# EAGLE design boron (EAGLE 8.1.1)
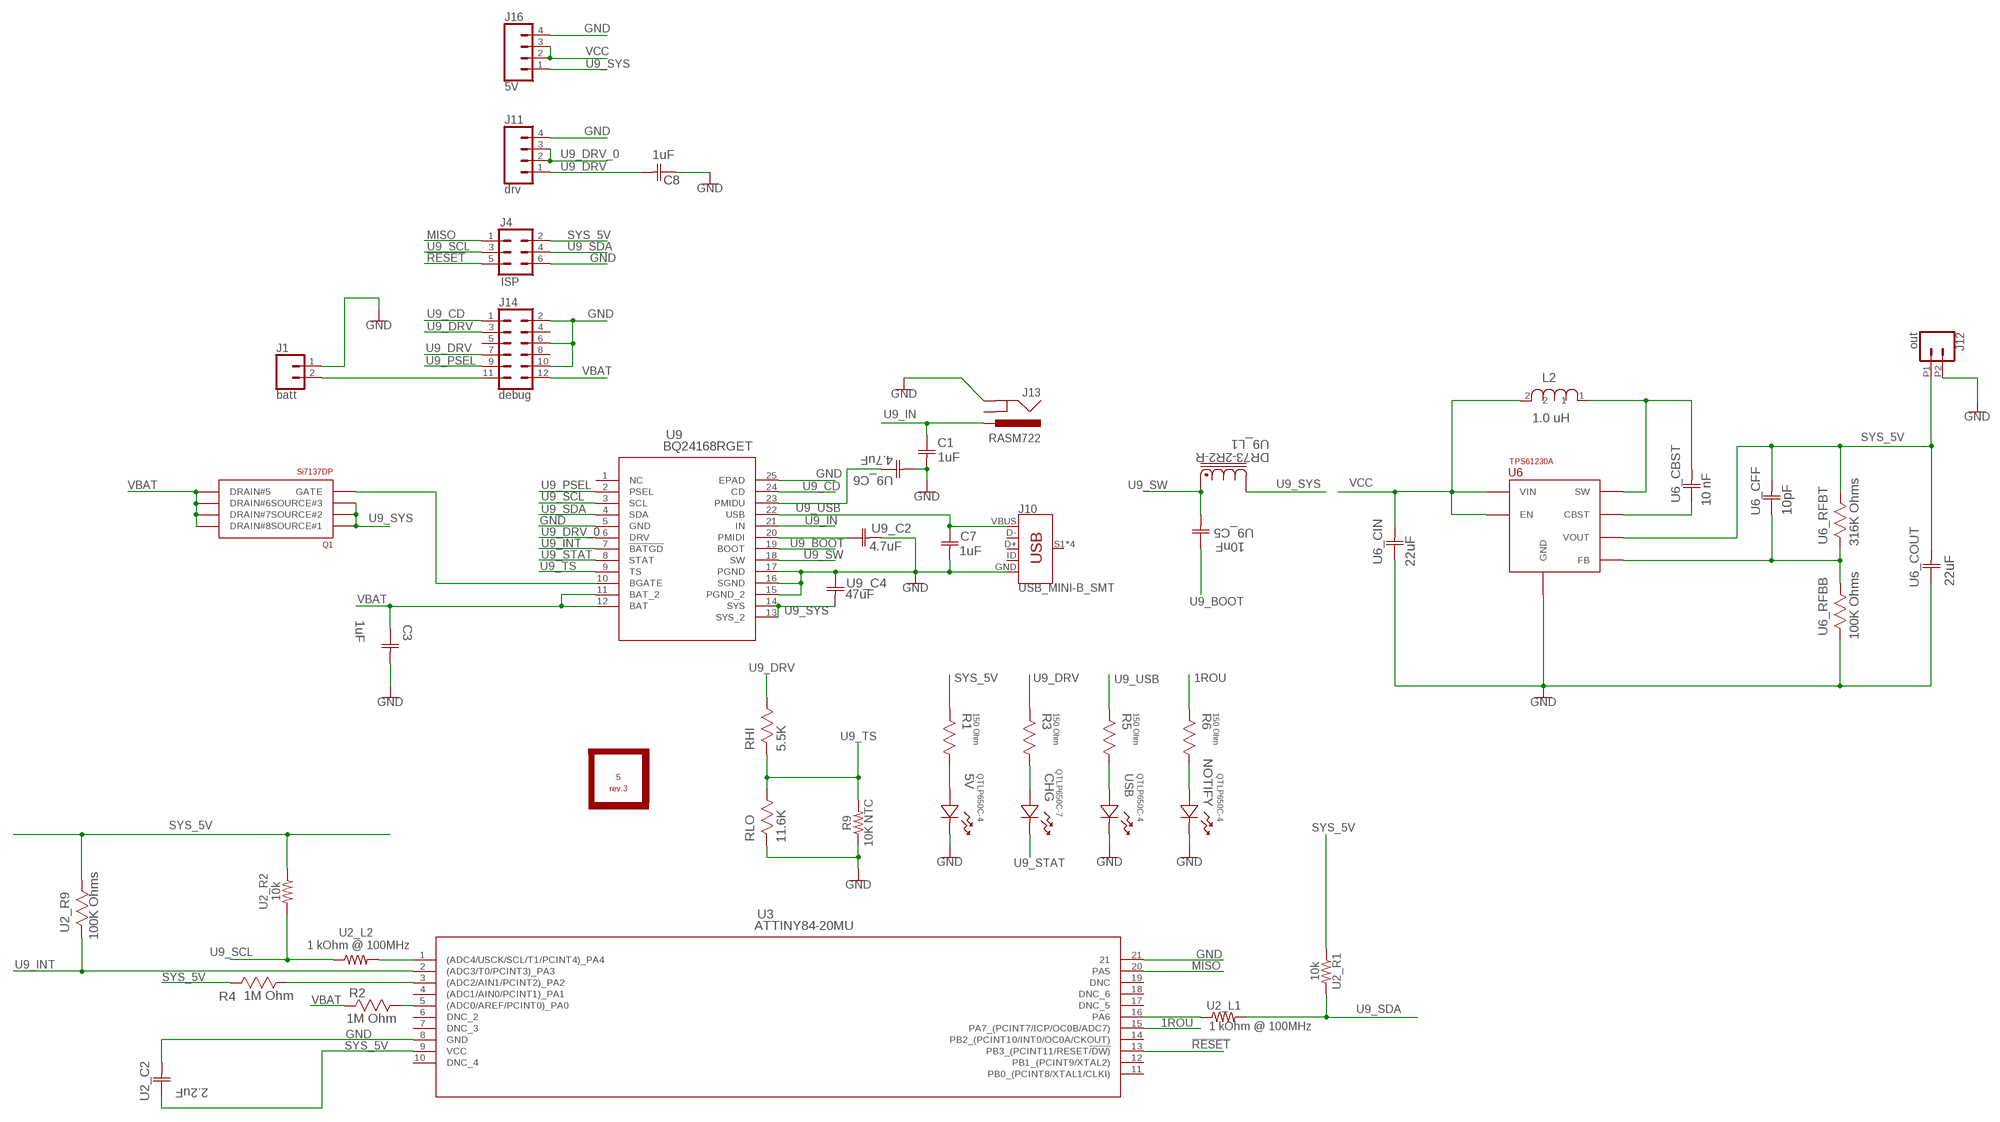
[diagram p0: schematic, sheet 1]

## Parts
5  rev.3  PERIODIC_SYMBOL  [PERIODIC_SYMBOL_BACK]
5V  QTLP650C-4  597-3311-407F  [LED_597-3311-407F]
C1  1uF  06033D105KAT2A  [CAPC1608X94N]
C3  1uF  06033D105KAT2A  [CAPC1608X94N]
C7  1uF  06033D105KAT2A  [CAPC1608X94N]
C8  1uF  06033D105KAT2A  [CAPC1608X94N]
CHG  QTLP650C-7  597-3111-407F  [LED_597-3111-407F]
J1  batt  CONN_02-JST-2MM-SMT  [JST-2-SMD]
J4  ISP  CONN_03X2FEMALE  [2X3]
J10  USB_MINI-B_SMT  [USB-MINIB]
J11  drv  CONN_04  [1X04]
J12  out  CONN_022.54MM_SCREWTERM  [1X02_2.54_SCREWTERM]
J13  RASM722  [RASM722]
J14  debug  CONN_06X2PTH_FEMALE  [2X6]
J16  5V  CONN_04  [1X04]
L2  1.0 uH  PM1210-1R0J-RC  [INDC3225X22N]
NOTIFY  QTLP650C-4  597-3311-407F  [LED_597-3311-407F]
Q1  Si7137DP  SI7137DP  [SO-8]
R1  150 Ohm  ERA-6AEB151V  [RESC2013X65N]
R2  1M Ohm  CRCW06031M00JNEA  [RESC1608X60N]
R3  150 Ohm  ERA-6AEB151V  [RESC2013X65N]
R4  1M Ohm  CRCW06031M00JNEA  [RESC1608X60N]
R5  150 Ohm  ERA-6AEB151V  [RESC2013X65N]
R6  150 Ohm  ERA-6AEB151V  [RESC2013X65N]
R9  10K NTC  NTHS1206N02N1002JE  [1206]
RHI  5.5K  CRCW060311K0FKEA  [RESC1608X60N]
RLO  11.6K  CRCW060311K0FKEA  [RESC1608X60N]
U2_C2  2.2uF  0402ZD225KAT2A  [CAPC1005X60N]
U2_L1  1 kOhm @ 100MHz  RESISTOR0402  [0402]
U2_L2  1 kOhm @ 100MHz  RESISTOR0402  [0402]
U2_R1  10k  RESISTOR0402  [0402]
U2_R2  10k  RESISTOR0402  [0402]
U2_R9  100K Ohms  CRCW0402100KJNED  [RESC1005X40N]
U3  ATTINY84-20MU  [20M1]
U6  TPS61230A  [VQFN7]
U6_CBST  10 nF  C0402C103K5RACTU  [CAPC1005X60N]
U6_CFF  10pF  C0603C100J5GACTU  [CAPC1608X85N]
U6_CIN  22uF  GRM21BR60J226ME39L  [CAPC2013X135N]
U6_COUT  22uF  GRM32ER61C226KE20L  [CAPC3225X270N]
U6_RFBB  100K Ohms  CRCW0402100KFKED  [RESC1005X40N]
U6_RFBT  316K Ohms  CRCW0402316KFKED  [RESC1005X40N]
U9  BQ24168RGET  [RGE24_2P7X2P7]
U9_C2  4.7uF  08053D475KAT2A  [CAPC2013X140N]
U9_C4  47uF  12067C332KAT2A  [CAPC3216X127N]
U9_C5  10nF  06035C103KAZ2A  [CAPC1608X90N]
U9_C6  4.7uF  08053D475KAT2A  [CAPC2013X140N]
U9_L1  DR73-2R2-R  [DR73]
USB  QTLP650C-4  597-3311-407F  [LED_597-3311-407F]

## Nets
1ROU: R6.2(R2) U3.15(PA7_(PCINT7/ICP/OC0B/ADC7))
!RESET: J4.5 U3.13(PB3_(PCINT11/RESET!/DW))
ADC0: R2.1 U3.5((ADC0/AREF/PCINT0)_PA0)
ADC2: R4.1 U3.3((ADC2/AIN1/PCINT2)_PA2)
GND: 5V.1 C1.2(C2) C3.2(C2) C7.2(C2) C8.1(C1) J1.1 J4.6 J10.GND J11.4 J12.P2 J13.SLEEVE(GND) J14.2 J14.6 J14.10 J16.4 NOTIFY.1 R9.1 RLO.2 U2_C2.1(C2) U3.8(GND) U3.21 U6.P$6(GND) U6_CIN.1(C1) U6_COUT.1(C1) U6_RFBB.2 U9.5(GND) U9.15(PGND_2) U9.16(SGND) U9.17(PGND) U9.25(EPAD) U9_C2.2(C2) U9_C4.1(C1) U9_C6.2(C2) USB.1
LA_1: NOTIFY.2 R6.1(R1)
LA_5: 5V.2 R1.1(R1)
LA_CHG: CHG.2 R3.1(R1)
LA_USB: R5.1(R1) USB.2
MISO: J4.1 U3.20(PA5)
SYS_5V: J4.2 J12.P1 R1.2(R2) R4.2 U2_C2.2(C1) U2_R1.1 U2_R2.1 U2_R9.1 U3.9(VCC) U6.P$7(VOUT) U6_CFF.2(C2) U6_COUT.2(C2) U6_RFBT.1
U3_PA4: U2_L2.2 U3.1((ADC4/USCK/SCL/T1/PCINT4)_PA4)
U3_PA6: U2_L1.1 U3.16(PA6)
U6_CBST: U6.P$1(CBST) U6_CBST.1(C1)
U6_FB: U6.P$3(FB) U6_CFF.1(C1) U6_RFBB.1 U6_RFBT.2
U6_SW: L2.1 U6.P$5(SW) U6_CBST.2(C2)
U9_BGATE: Q1.P$4(GATE) U9.10(BGATE)
U9_BOOT: U9.19(BOOT) U9_C5.1(C1)
U9_CD: J14.1 U9.24(CD)
U9_DRV: C8.2(C2) J11.1 J14.3 J14.7 R3.2(R2) RHI.1
U9_DRV_0: J11.2 J11.3 U9.6(DRV)
U9_IN: C1.1(C1) J13.TIP(PWR) U9.21(IN)
U9_INT: U2_R9.2 U3.2((ADC3/T0/PCINT3)_PA3) U9.7(!BATGD)
U9_PMIDI: U9.20(PMIDI) U9_C2.1(C1)
U9_PMIDU: U9.23(PMIDU) U9_C6.1(C1)
U9_PSEL: J14.9 U9.2(PSEL)
U9_SCL: J4.3 U2_L2.1 U2_R2.2 U9.3(SCL)
U9_SDA: J4.4 U2_L1.2 U2_R1.2 U9.4(SDA)
U9_STAT: CHG.1 U9.8(STAT)
U9_SW: U9.18(SW) U9_C5.2(C2) U9_L1.1
U9_SYS: J16.1 Q1.P$1(SOURCE#1) Q1.P$2(SOURCE#2) Q1.P$3(SOURCE#3) U9.13(SYS_2) U9.14(SYS) U9_C4.2(C2) U9_L1.2
U9_TS: R9.2 RHI.2 RLO.1 U9.9(TS)
U9_USB: C7.1(C1) J10.VBUS R5.2(R2) U9.22(USB)
VBAT: C3.1(C1) J14.12 Q1.P$5(DRAIN#5) Q1.P$6(DRAIN#6) Q1.P$7(DRAIN#7) Q1.P$8(DRAIN#8) Q1.P$9(DRAIN#8) R2.2 U9.11(BAT_2) U9.12(BAT)
VBAT_CON: J1.2 J14.11
VCC: J16.2 J16.3 L2.2 U6.P$2(EN) U6.P$4(VIN) U6_CIN.2(C2)
Unconnected: J10.D+ J10.D- J10.ID J10.S1(SHIELD) J10.S2(SHIELD) J10.S3(SHIELD) J10.S4(SHIELD) J14.4 J14.5 J14.8 U3.4((ADC1/AIN0/PCINT1)_PA1) U3.6(DNC_2) U3.7(DNC_3) U3.10(DNC_4) U3.11(PB0_(PCINT8/XTAL1/CLKI)) U3.12(PB1_(PCINT9/XTAL2)) U3.14(PB2_(PCINT10/INT0/OC0A/CKOUT)) U3.17(DNC_5) U3.18(DNC_6) U3.19(DNC) U9.1(NC)

## Power pins joined to a net without a drawn wire
GNDBREAK: J13.SHUNT(GNDBREAK)

## Library data of the parts
5 = 32bits:PERIODIC_SYMBOL; ELEMENT: B
5V NOTIFY USB = Dialight_By_element14_Batch_1:597-3311-407F: LED 1206 Green SMT; COLOR: Green; MPN: 597-3311-407F; OC_FARNELL: 1519493; OC_NEWARK: 30K4957; PACKAGE: 1206- Green LED; SUPPLIER: Dialight
C1 C3 C7 C8 = AVX_By_element14_Batch_1:06033D105KAT2A: Capacitor 0603; MPN: 06033D105KAT2A; OC_FARNELL: 1658868; OC_NEWARK: 96M1265; SUPPLIER: AVX; TOLERANCE: ±10%; VOLTAGERATING: 25V
CHG = Dialight_By_element14_Batch_1:597-3111-407F: LED 1206 ALGAAS RED SMT; COLOR: AlGaAs Red; MPN: 597-3111-407F; OC_FARNELL: 1519490; OC_NEWARK: 30K4900; PACKAGE: 1206-RED LED; SUPPLIER: Dialight
J1 = SparkFun-Connectors:CONN_02: Multi connection point. Often used as Generic Header-pin footprint for 0.1 inch spaced/style header connections On any of the 0.1 inch spaced packages, you can populate with these: Break Away Headers - Straight <https://www.sparkfun.com/products/116> (PRT-00116) Break Away Male Headers - Right Angle <https://www.sparkfun.com/products/553> (PRT-00553) Female Headers <https://www.sparkfun.com/products/115> (PRT-00115) Break Away Headers - Machine Pin <https://www.sparkfun.com/products/117> (PRT-00117) Break Away Female Headers - Swiss Machine Pin <https://www.sparkfun.com/products/743> (PRT-00743) For SCREWTERMINALS and SPRING TERMINALS visit here: Screw Terimnals on SparkFun.com <https://www.sparkfun.com/search/results?term=Screw+Terminals> (5mm/3.5mm/2.54mm spacing) This device is also useful as a general connection point to wire up your design to another part of your project. Our various solder wires solder well into these plated through hole pads. Hook-Up Wire - Assortment (Stranded, 22 AWG) <https://www.sparkfun.com/products/11375> (PRT-11375) Hook-Up Wire - Assortment (Solid Core, 22 AWG) <https://www.sparkfun.com/products/11367> (PRT-11367) View the entire wire category on our website here <https://www.sparkfun.com/categories/141> Special notes: Molex polarized connector foot print use with: PRT-08233 with associated crimp pins and housings. 2.54_SCREWTERM for use with PRT-10571. 3.5mm Screw Terminal footprints for PRT-08084 5mm Screw Terminal footprints for use with PRT-08432; PROD_ID: CONN-11443
J4 = SparkFun-Connectors:CONN_03X2: Multi connection point. Often used as Generic Header-pin footprint for 0.1 inch spaced/style header connections You can populate with any combo of single row headers, but if you'd like an exact match, check these: Header - 2x3 (Male, 0.1") <https://www.sparkfun.com/products/12807> (PRT-12807) Header - 2x3 (Female, 0.1") <https://www.sparkfun.com/products/13010> (PRT-13010) 2x3 Pin Shrouded Header <https://www.sparkfun.com/products/10877> (PRT-10877) On any of the 0.1 inch spaced packages, you can populate with these: Break Away Headers - Straight <https://www.sparkfun.com/products/116> (PRT-00116) Break Away Male Headers - Right Angle <https://www.sparkfun.com/products/553> (PRT-00553) Female Headers <https://www.sparkfun.com/products/115> (PRT-00115) Break Away Headers - Machine Pin <https://www.sparkfun.com/products/117> (PRT-00117) Break Away Female Headers - Swiss Machine Pin <https://www.sparkfun.com/products/743> (PRT-00743) Special note: the shrouded connector mates well with our 3x2 ribbon cables: Ribbon Crimp Connector - 6-pin (2x3, Female) <https://www.sparkfun.com/products/10651> (PRT-10651) Ribbon Cable - 6 wire (15ft) <https://www.sparkfun.com/products/10646> (PRT-10646); PROD_ID: CONN-11566; VALUE: FEMALE 2x3
J10 = SparkFun-Connectors:USB_MINI-B: USB type Mini-B Connector Breaks out 5th pin, and includes shield pins if needed. SparkFun Products: SparkFun FTDI Basic Breakout <https://www.sparkfun.com/products/9716> SparkFun XBee Explorer USB <https://www.sparkfun.com/products/11812> SparkFun Redboard <https://www.sparkfun.com/products/12757>; PROD_ID: CONN-08193; SF_ID: PRT-00587
J11 J16 = SparkFun-Connectors:CONN_04: Multi connection point. Often used as Generic Header-pin footprint for 0.1 inch spaced/style header connections On any of the 0.1 inch spaced packages, you can populate with these: Break Away Headers - Straight <https://www.sparkfun.com/products/116> (PRT-00116) Break Away Male Headers - Right Angle <https://www.sparkfun.com/products/553> (PRT-00553) Female Headers <https://www.sparkfun.com/products/115> (PRT-00115) Break Away Headers - Machine Pin <https://www.sparkfun.com/products/117> (PRT-00117) Break Away Female Headers - Swiss Machine Pin <https://www.sparkfun.com/products/743> (PRT-00743) For SCREWTERMINALS and SPRING TERMINALS visit here: Screw Terimnals on SparkFun.com <https://www.sparkfun.com/search/results?term=Screw+Terminals> (5mm/3.5mm/2.54mm spacing) This device is also useful as a general connection point to wire up your design to another part of your project. Our various solder wires solder well into these plated through hole pads. Hook-Up Wire - Assortment (Stranded, 22 AWG) <https://www.sparkfun.com/products/11375> (PRT-11375) Hook-Up Wire - Assortment (Solid Core, 22 AWG) <https://www.sparkfun.com/products/11367> (PRT-11367) View the entire wire category on our website here <https://www.sparkfun.com/categories/141> Special notes: Molex polarized connector foot print use with SKU : PRT-08231 with associated crimp pins and housings. 1MM SMD Version SKU: PRT-10208; PROD_ID: CONN-09696
J12 = SparkFun-Connectors:CONN_02: Multi connection point. Often used as Generic Header-pin footprint for 0.1 inch spaced/style header connections On any of the 0.1 inch spaced packages, you can populate with these: Break Away Headers - Straight <https://www.sparkfun.com/products/116> (PRT-00116) Break Away Male Headers - Right Angle <https://www.sparkfun.com/products/553> (PRT-00553) Female Headers <https://www.sparkfun.com/products/115> (PRT-00115) Break Away Headers - Machine Pin <https://www.sparkfun.com/products/117> (PRT-00117) Break Away Female Headers - Swiss Machine Pin <https://www.sparkfun.com/products/743> (PRT-00743) For SCREWTERMINALS and SPRING TERMINALS visit here: Screw Terimnals on SparkFun.com <https://www.sparkfun.com/search/results?term=Screw+Terminals> (5mm/3.5mm/2.54mm spacing) This device is also useful as a general connection point to wire up your design to another part of your project. Our various solder wires solder well into these plated through hole pads. Hook-Up Wire - Assortment (Stranded, 22 AWG) <https://www.sparkfun.com/products/11375> (PRT-11375) Hook-Up Wire - Assortment (Solid Core, 22 AWG) <https://www.sparkfun.com/products/11367> (PRT-11367) View the entire wire category on our website here <https://www.sparkfun.com/categories/141> Special notes: Molex polarized connector foot print use with: PRT-08233 with associated crimp pins and housings. 2.54_SCREWTERM for use with PRT-10571. 3.5mm Screw Terminal footprints for PRT-08084 5mm Screw Terminal footprints for use with PRT-08432
J13 = 32bits:RASM722: RASM722X Switchcraft Power Barrel Connector Jack 2.10mm ID (0.083"), 5.50mm OD (0.217") Surface Mount, Right Angle
J14 = SparkFun-Connectors:CONN_06X2: Multi connection point. Often used as Generic Header-pin footprint for 0.1 inch spaced/style header connections On any of the 0.1 inch spaced packages, you can populate with these: Break Away Headers - Straight <https://www.sparkfun.com/products/116> (PRT-00116) Break Away Male Headers - Right Angle <https://www.sparkfun.com/products/553> (PRT-00553) Female Headers <https://www.sparkfun.com/products/115> (PRT-00115) Break Away Headers - Machine Pin <https://www.sparkfun.com/products/117> (PRT-00117) Break Away Female Headers - Swiss Machine Pin <https://www.sparkfun.com/products/743> (PRT-00743); PROD_ID: CONN-12423; VALUE: 2X6 FEMALE
L2 = Bourns_By_element14_Batch_1:PM1210-1R0J-RC: CHIP INDUCTOR, 1UH, 400MA 5% 120MHZ; MPN: PM1210-1R0J-RC; OC_FARNELL: 1180462; OC_NEWARK: 63K3090; SUPPLIER: BOURNS; TOLERANCE: ±5 %
Q1 = 32bits:SI7137DP: P-Channel 20-V (D-S) MOSFET Vishay Siliconix RDS: 0.0025 at VGS = - 4.5 V
R1 R3 R5 R6 = Panasonic_By_element14_Batch_1:ERA-6AEB151V: RESISTOR, 0805; MPN: ERA-6AEB151V; OC_FARNELL: 1811409; OC_NEWARK: 08N2149; SUPPLIER: Panasonic; TOLERANCE: ±0.1 %; WATTAGE: 0.125 W
R2 R4 = Vishay_By_element14_Batch_1:CRCW06031M00JNEA: RESISTOR, 0603; MPN: CRCW06031M00JNEA; OC_FARNELL: 1514706; OC_NEWARK: 59M6756; SUPPLIER: VISHAY DALE ELECTRONICS; TOLERANCE: ±5%; WATTAGE: 0.1 W
R9 = 32bits:NTHS1206N02N1002JE: NTC Thermistors SMD 0402, 0603, 0805, 1206 Chip FEATURES QUICK REFERENCE DATA PARAMETER VALUE UNIT Resistance value at 25 °C 4.7K to 350K Ω Tolerance on R25-value ± 1, ± 2, ± 3, ± 5, ± 10 % B25/75 -value 3477 to 4247 K B25/85 -value 3486 to 4261 K Tolerance on B25/85 - value, B25/75 -value ± 3 % Operating temperature range at zero power (intermittent) -40 to +125 (150) °C
RHI RLO = Vishay_By_element14_Batch_1:CRCW060311K0FKEA: RESISTOR, 0603; MPN: CRCW060311K0FKEA; OC_FARNELL: 1570716; OC_NEWARK: 89M6730; SUPPLIER: VISHAY DALE ELECTRONICS; TOLERANCE: ±1%; VALUE: 11K Ohms; WATTAGE: 0.1 W
U2_C2 = AVX_By_element14_Batch_1:0402ZD225KAT2A: Capacitor 0402; MPN: 0402ZD225KAT2A; OC_FARNELL: 1867952; OC_NEWARK: -; SUPPLIER: AVX; TOLERANCE: ±10%; VOLTAGERATING: 10V
U2_L1 U2_L2 U2_R1 U2_R2 = SparkFun-Resistors:RESISTOR: Generic Resistor Package
U2_R9 = Vishay_By_element14_Batch_1:CRCW0402100KJNED: RESISTOR, 0402; MPN: CRCW0402100KJNED; OC_FARNELL: 1652738; OC_NEWARK: 59M6699; SUPPLIER: Vishay; TOLERANCE: ±5%; WATTAGE: 0.063W
U3 = 32bits:ATTINY84-20MU; MANUFACTURER_PART_NUMBER: ATTINY8420MU; VENDOR: Atmel
U6 = 32bits:TPS61230A
U6_CBST = Kemet_By_element14_Batch_1:C0402C103K5RACTU: CAPACITOR, 0402; MPN: C0402C103K5RACTU; OC_FARNELL: 1414575; OC_NEWARK: 78H4783; SUPPLIER: Kemet; TOLERANCE: ±10%; VOLTAGERATING: 50V
U6_CFF = Kemet_By_element14_Batch_1:C0603C100J5GACTU: CAPACITOR, 0603; MPN: C0603C100J5GACTU; OC_FARNELL: 1414601; OC_NEWARK: 64K2831; SUPPLIER: Kemet; TOLERANCE: ±5%; VOLTAGERATING: 50V
U6_CIN = Murata_By_element14_Batch_1:GRM21BR60J226ME39L: CAPACITOR, 0805; MPN: GRM21BR60J226ME39L; OC_FARNELL: 1735531; OC_NEWARK: 24R6338; SUPPLIER: Murata; TOLERANCE: ±20%; VOLTAGERATING: 6.3V
U6_COUT = Murata_By_element14_Batch_1:GRM32ER61C226KE20L: CAPACITOR, 1210; MPN: GRM32ER61C226KE20L; OC_FARNELL: 9527800; OC_NEWARK: 97K0673; SUPPLIER: Murata; TOLERANCE: ±10%; VOLTAGERATING: 16V
U6_RFBB = Vishay_By_element14_Batch_1:CRCW0402100KFKED: RESISTOR, 0402; MPN: CRCW0402100KFKED; OC_FARNELL: 1469671; OC_NEWARK: -; SUPPLIER: Vishay; TOLERANCE: ±1%; WATTAGE: 0.063W
U6_RFBT = Vishay_By_element14_Batch_1:CRCW0402316KFKED: RESISTOR, 0402; MPN: CRCW0402316KFKED; OC_FARNELL: 1652782; OC_NEWARK: 52K6969; SUPPLIER: Vishay; TOLERANCE: ±1%; WATTAGE: 0.063W
U9 = 32bits:BQ24168RGET; MANUFACTURER_PART_NUMBER: bq24168rget; VENDOR: Texas Instruments
U9_C2 U9_C6 = AVX_By_element14_Batch_1:08053D475KAT2A: Capacitor 0805; MPN: 08053D475KAT2A; OC_FARNELL: 1657932; OC_NEWARK: 27M3797; SUPPLIER: AVX; TOLERANCE: ±10%; VOLTAGERATING: 25V
U9_C4 = AVX_By_element14_Batch_1:12067C332KAT2A: Capacitor 1206; MPN: 12067C332KAT2A; OC_FARNELL: -; OC_NEWARK: 89C3187; SUPPLIER: AVX; TOLERANCE: ±10%; VALUE: 3300PF; VOLTAGERATING: 500V
U9_C5 = AVX_By_element14_Batch_1:06035C103KAZ2A: Capacitor 0603; MPN: 06035C103KAZ2A; OC_FARNELL: 7569548; OC_NEWARK: 10R5936; SUPPLIER: AVX; TOLERANCE: ±10%; VOLTAGERATING: 50V
U9_L1 = 32bits:DR73-2R2-R; MANUFACTURER_PART_NUMBER: DR732R2R; VENDOR: Cooper Bussmann

## Board
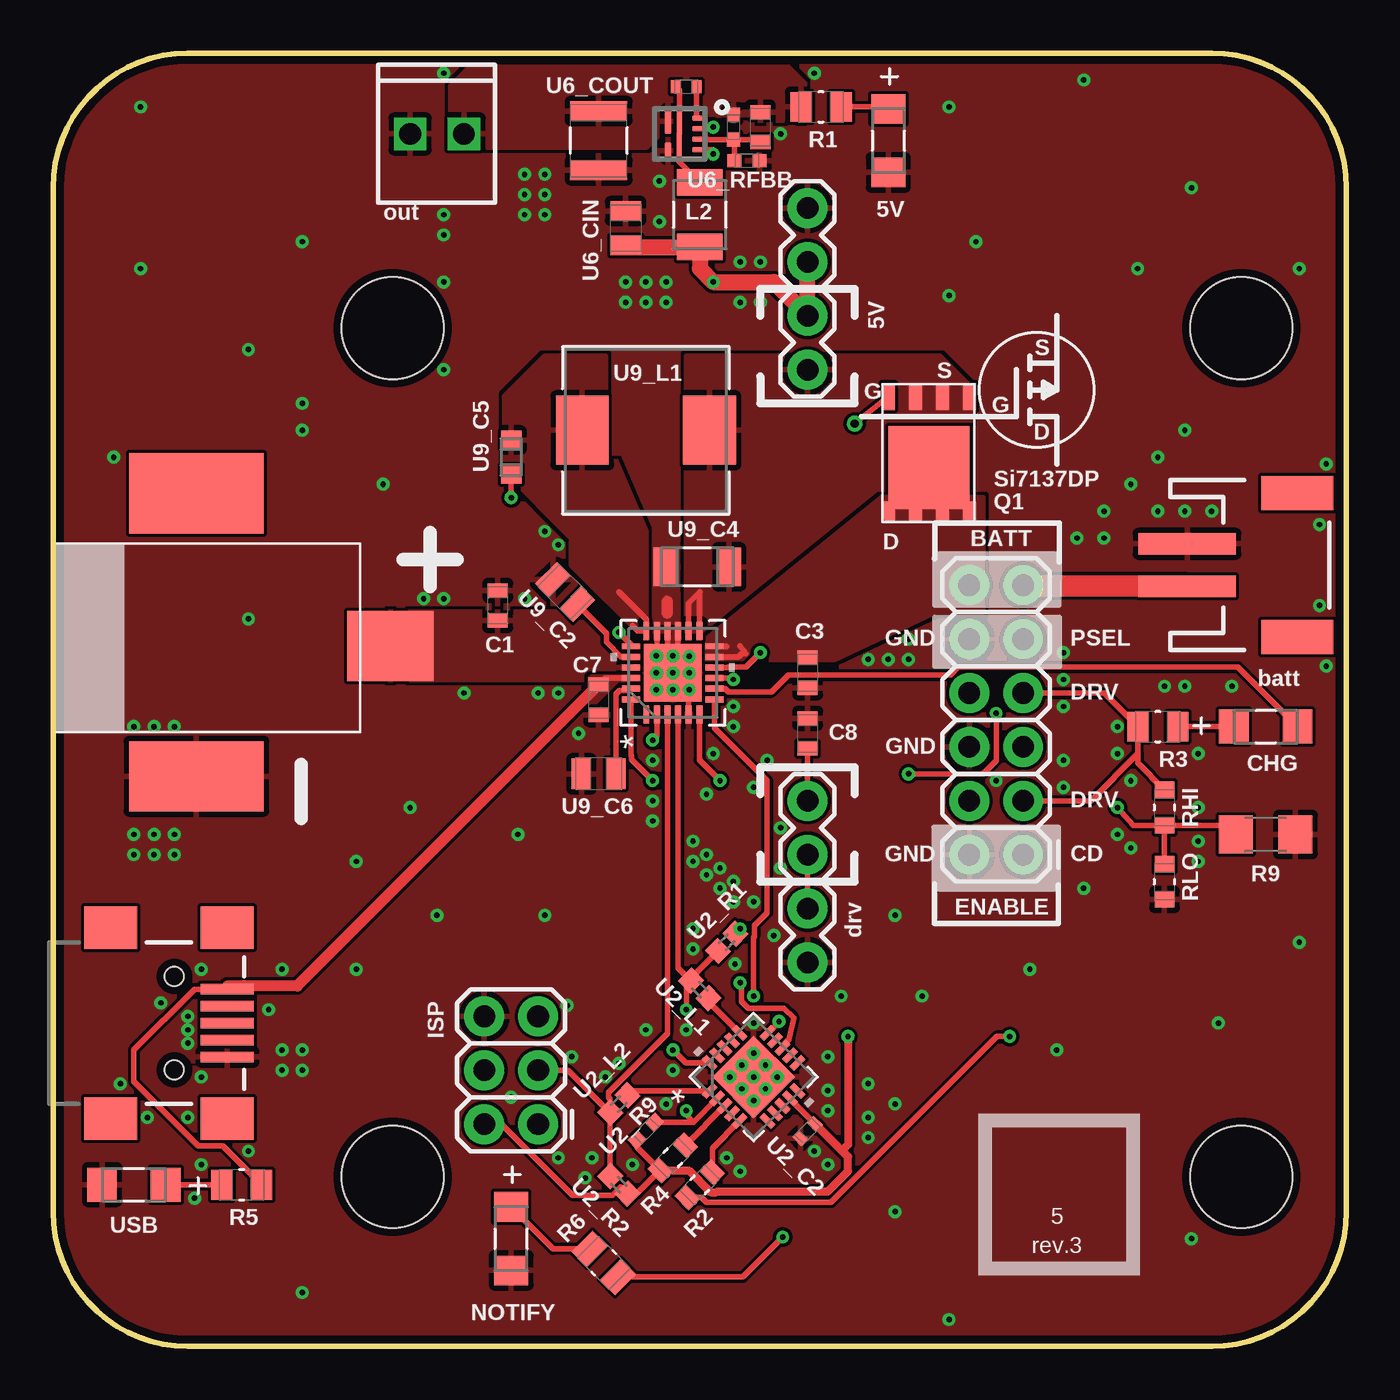
[diagram p1: board, top side]
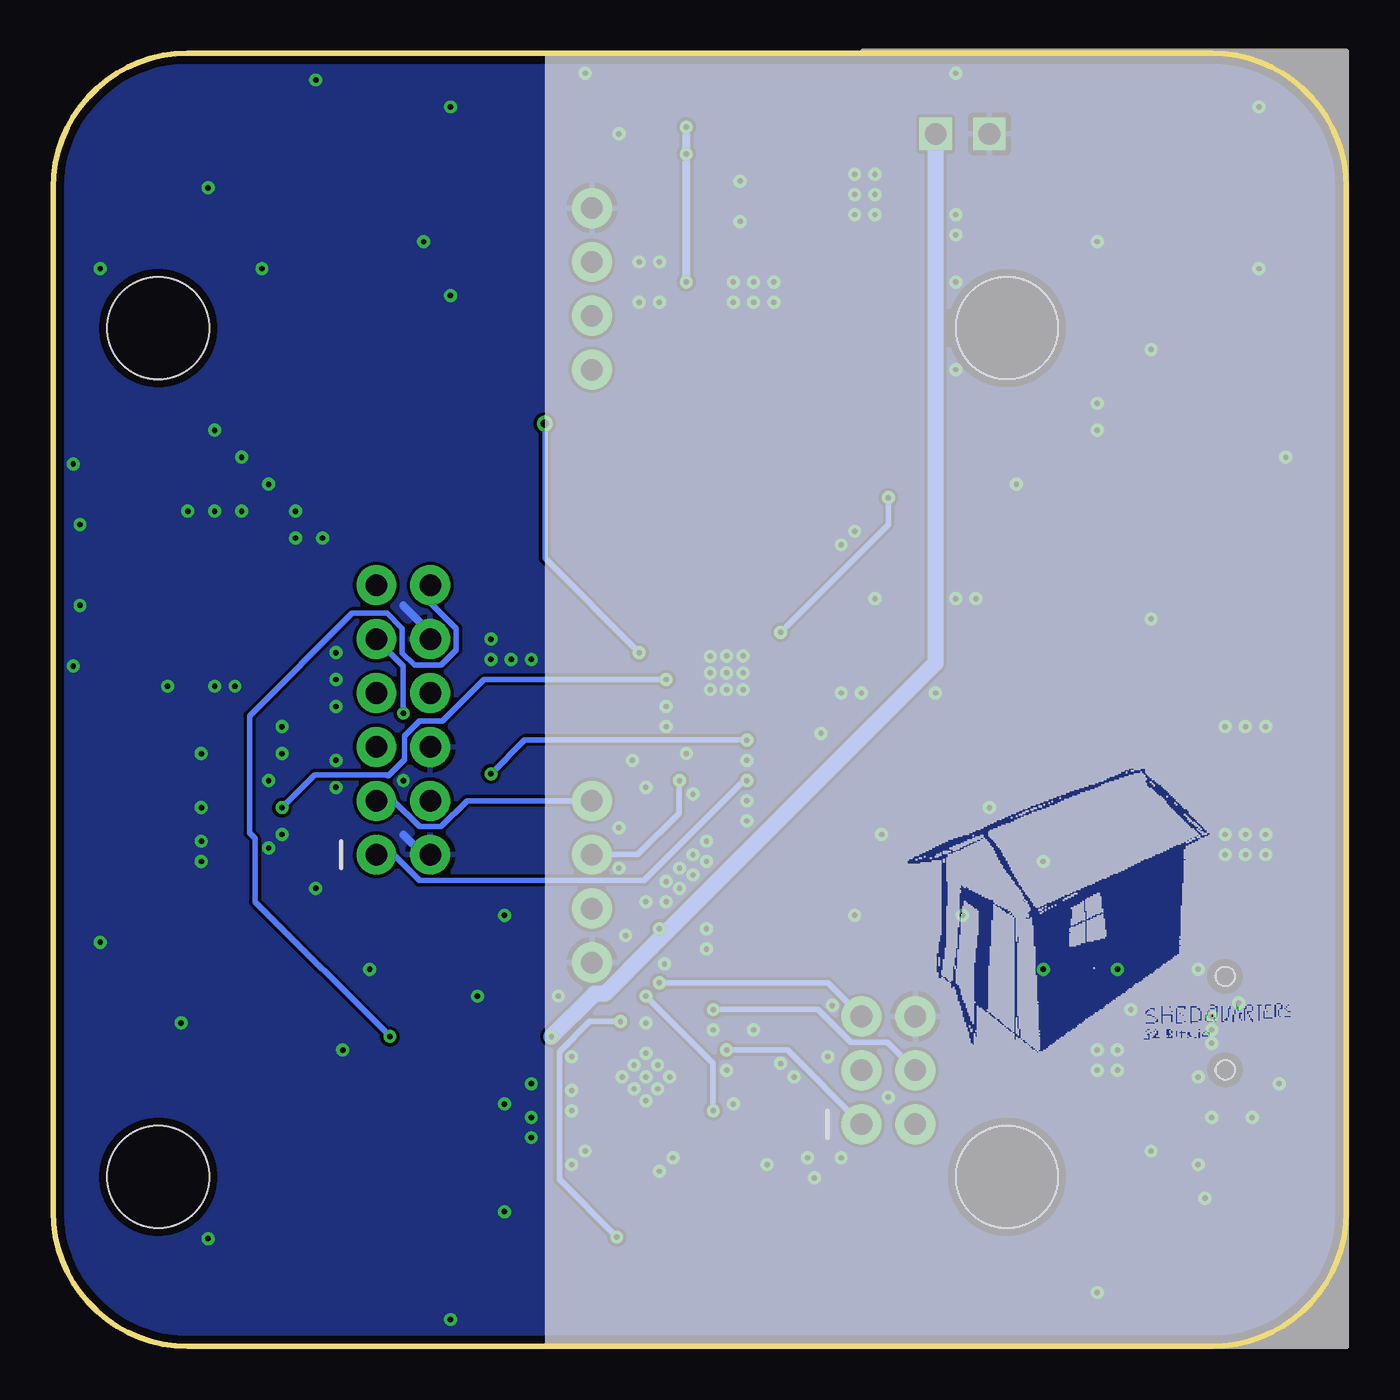
[diagram p2: board, bottom side, seen from below]

Size 60.96 x 60.96 mm. Coordinates in mm from the lower left corner, seen from the top.
Outline: 0,6.35 0,54.61 arc-90 6.35,60.96 54.61,60.96 arc-90 60.96,54.61 60.96,6.35 arc-90 54.61,0 6.35,0 arc-90 0,6.35
Copper layers (1*16): Top 0.0356mm / dielectric 1.5011mm / Bottom 0.0356mm
Design rules "oshpark-2layer *": minimum track width 6mil, minimum drill 10mil, track to track 6mil, track to pad 6mil, pad to pad 6mil, via to via 6mil, smd to smd 0mil, copper to edge 15mil, drill to drill 6mil, minimum pad ring 7mil, minimum via ring 7mil, stop-mask expansion 2.5mil, vias tented up to drill 20mil, thermal gap 10mil
Holes 4.8 mm at 56,48 16,48 56,8 16,8

### Footprints (pad centres in the part's own frame; a part is rotated, then mirrored left to right if it is on the bottom)
LED_597-3311-407F = smd 1.397 x 1.6: 1 -1.499,0; 2 1.499,0
CAPC1608X94N = smd 0.66 x 0.94: 1 -0.711,0; 2 0.711,0
LED_597-3111-407F = smd 1.397 x 1.6: 1 -1.499,0; 2 1.499,0
JST-2-SMD = smd 1 x 4.6: 1 -1,-3.7; 2 1,-3.7 | smd 1.6 x 3.4: NC1 -3.4,1.5; NC2 3.4,1.5
2X3 = drill 1.016 pad 1.88: 1 0,0; 2 0,2.54; 3 2.54,0; 4 2.54,2.54; 5 5.08,0; 6 5.08,2.54
USB-MINIB = smd 2.5 x 0.5: D+ 2.5,0; D- 2.5,0.8; GND 2.5,-1.6; ID 2.5,-0.8; VBUS 2.5,1.6 | smd 2.5 x 2: S1 -3,4.5; S2 2.5,4.5; S3 -3,-4.5; S4 2.5,-4.5 | hole 0.9: 0,2.2; 0,-2.2
1X04 = drill 1.016 pad 1.88: 1 0,0; 2 2.54,0; 3 5.08,0; 4 7.62,0
1X02_2.54_SCREWTERM = drill 1.016 square: P1 2.54,0; P2 0,0
RASM722 = smd 3.81 x 6.35: SHUNT -7.188,6.756 | smd 3.302 x 6.35: SLEEVE 6.147,6.756 | smd 3.302 x 4.064: TIP 0,15.9
2X6 = drill 1.016 pad 1.88: 1 0,0; 2 0,2.54; 3 2.54,0; 4 2.54,2.54; 5 5.08,0; 6 5.08,2.54; 7 7.62,0; 8 7.62,2.54; 9 10.16,0; 10 10.16,2.54; 11 12.7,0; 12 12.7,2.54
INDC3225X22N = smd 1.245 x 2.159: 1 -1.524,0; 2 1.524,0
SO-8 = smd 1.27 x 0.61: P$1 0,0; P$2 0,-1.27; P$3 0,-2.54; P$4 0,-3.81 | smd 1.016 x 0.61: P$5 5.461,-3.81; P$6 5.461,-2.54; P$7 5.461,-1.27; P$8 5.461,0 | smd 3.912 x 3.81: P$9 3.353,-1.905
RESC2013X65N = smd 1.016 x 1.397: 1 -0.94,0; 2 0.94,0
RESC1608X60N = smd 0.762 x 0.94: 1 -0.838,0; 2 0.838,0
1206 = smd 1.6 x 1.8: 1 -1.4,0; 2 1.4,0
CAPC1005X60N = smd 0.457 x 0.61: 1 -0.483,0; 2 0.483,0
0402 = smd 0.85 x 0.9: 1 -0.58,0; 2 0.58,0
RESC1005X40N = smd 0.66 x 0.61: 1 -0.584,0; 2 0.584,0
20M1 = smd 0.762 x 0.305: 1 -1.93,1; 2 -1.93,0.5; 3 -1.93,0; 4 -1.93,-0.5; 5 -1.93,-1; 11 1.93,-1; 12 1.93,-0.5; 13 1.93,0; 14 1.93,0.5; 15 1.93,1 | smd 0.305 x 0.762: 6 -1,-1.93; 7 -0.5,-1.93; 8 0,-1.93; 9 0.5,-1.93; 10 1,-1.93; 16 1,1.93; 17 0.5,1.93; 18 0,1.93; 19 -0.5,1.93; 20 -1,1.93 | smd 2.743 x 2.743: 21 0,0
VQFN7 = smd 0.25 x 0.6: P$1 -0.75,0.9; P$2 -0.25,0.9; P$3 0.25,0.9; P$4 0.75,0.9 | smd 2.38 x 0.25: P$5 0,-0.015 | smd 0.8 x 0.3: P$6 0.8,-0.54 | smd 1.2 x 0.3: P$7 -0.6,-0.54
CAPC1608X85N = smd 0.66 x 0.94: 1 -0.711,0; 2 0.711,0
CAPC2013X135N = smd 0.914 x 1.448: 1 -0.813,0; 2 0.813,0
CAPC3225X270N = smd 0.914 x 2.692: 1 -1.397,0; 2 1.397,0
RGE24_2P7X2P7 = smd 0.85 x 0.28: 1 -1.975,1.25; 2 -1.975,0.75; 3 -1.975,0.25; 4 -1.975,-0.25; 5 -1.975,-0.75; 6 -1.975,-1.25; 13 1.975,-1.25; 14 1.975,-0.75; 15 1.975,-0.25; 16 1.975,0.25; 17 1.975,0.75; 18 1.975,1.25 | smd 0.28 x 0.85: 7 -1.25,-1.975; 8 -0.75,-1.975; 9 -0.25,-1.975; 10 0.25,-1.975; 11 0.75,-1.975; 12 1.25,-1.975; 19 1.25,1.975; 20 0.75,1.975; 21 0.25,1.975; 22 -0.25,1.975; 23 -0.75,1.975; 24 -1.25,1.975 | smd 2.7 x 2.7: 25 0,0
CAPC2013X140N = smd 0.914 x 1.448: 1 -0.813,0; 2 0.813,0
CAPC3216X127N = smd 1.118 x 1.803: 1 -1.499,0; 2 1.499,0
CAPC1608X90N = smd 0.864 x 0.965: 1 -0.813,0; 2 0.813,0
DR73 = smd 2.489 x 3.251: 1 -2.997,0; 2 2.997,0

### Placement (x,y rotation side)
5  49.96,4.62 0 bottom
5V  39.37,56.83 90 top
C1  20.95,34.92 90 top
C3  35.56,31.75 270 top
C7  25.72,30.48 270 top
C8  35.56,28.89 270 top
CHG  57.15,29.21 180 top
J1  57.15,36.83 270 top
J4  22.86,10.48 90 top
J10  5.71,15.24 0 top
J11  35.56,25.72 270 top
J12  16.83,57.15 0 top
J13  0,33.02 270 top
J14  45.72,23.18 90 top
J16  35.56,46.04 90 top
L2  30.48,53.34 270 top
NOTIFY  21.59,5.08 90 top
Q1  43.18,44.77 270 top
R1  36.2,58.42 180 top
R2  30.48,7.62 225 top
R3  52.07,29.21 180 top
R4  29.21,8.89 225 top
R5  8.89,7.62 0 top
R6  25.96,3.94 315 top
R9  57.15,24.13 180 top
RHI  52.39,25.4 270 top
RLO  52.39,21.91 270 top
U2_C2  35.56,10.16 45 top
U2_L1  30.48,16.83 135 top
U2_L2  26.67,11.43 45 top
U2_R1  31.75,19.05 225 top
U2_R2  26.67,7.62 135 top
U2_R9  27.94,10.16 45 top
U3  33.02,12.7 45 top
U6  29.53,57.15 270 top
U6_CBST  29.84,59.37 180 top
U6_CFF  33.34,57.47 90 top
U6_CIN  26.99,52.7 270 top
U6_COUT  25.72,56.83 90 top
U6_RFBB  32.7,55.88 0 top
U6_RFBT  32.07,57.47 270 top
U9  29.21,31.75 90 top
U9_C2  24.13,35.56 135 top
U9_C4  30.37,36.74 0 top
U9_C5  21.59,41.91 90 top
U9_C6  25.72,26.99 180 top
U9_L1  27.94,43.18 0 top
USB  3.81,7.62 0 top

### Tracks (layer width: path | path; a pad name or v marks a point on that pad's centre or on a via)
1ROU  (via drill 0.25)
  Top 0.254: U3.15 34.21,15.31 v34.21,15.32 | 26.69,3.27 R6.2 32.51,3.27 v34.39,5.16
  Bottom 0.254: v34.21,15.32 35.67,15.32 37.1,13.89 37.1,7.89 v34.39,5.16
!RESET  (via drill 0.25)
  Top 0.254: U3.13 34.38,14.16 34.69,14.46 34.92,15.48 34.45,15.93 32.78,15.93 32.44,16.27 32.44,17.09 v32.38,17.14
  Bottom 0.254: v32.38,17.14 24.45,17.14 J4.5
ADC0
  Top 0.254: R2.1 31.07,9.34 U3.5
ADC2
  Top 0.254: R4.1 U3.3
GND  (via drill 0.25)
  Top 0.254: 29.46,33.85 U9.15 29.46,32.95 v29.21,32.55 28.96,32.95 U9.16 | 28.89,35.24 28.96,35.17 28.96,34.54 | U9.5 29.96,30.59 v29.98,30.95 | U9.17 28.46,32.91 v28.43,32.55
  Top 0.508: 28.96,34.54 28.96,35.13
  Bottom 0.381: J14.2 43.5,23.18 44.45,24.13 | J14.10 43.18,33.66 44.45,34.92
  other vias: 32.38,8.26 31.75,8.89 35.88,9.21 36.51,8.57 29.21,31.75 30.16,19.68 30.16,18.73 33.02,20.95 30.16,23.81 30.16,22.86 28.44,31.75 28.44,30.95 29.21,30.95 29.98,31.75 29.98,32.52 28.26,25.72 28.26,24.77 24.77,28.89 32.07,29.21 32.07,30.16 38.42,12.38 38.42,10.79 38.42,9.84 22.23,53.34 23.18,53.34 22.23,55.24 23.18,55.24 23.18,54.29 22.23,54.29 28.57,54.93 28.57,53.02 22.86,30.8 23.81,30.8 23.18,38.42 23.81,37.78 28.89,50.16 27.94,50.16 26.99,50.16 26.99,49.21 27.94,49.21 28.89,49.21 32.38,51.12 33.34,51.12 33.34,49.21 32.38,49.21 35.88,60.01 18.41,60.01 34.29,57.15 53.98,27.94 53.98,25.4 53.34,31.11 52.39,31.11 50.16,24.13 50.8,23.5 53.98,23.81 53.98,22.86 36.51,13.65 36.51,12.06 36.51,11.11 27.94,14.92 26.67,13.34 26.04,12.7 24.45,13.65 21.59,11.75 23.81,8.89 25.4,8.89 25.08,7.94 29.84,14.92 29.21,13.02 28.89,11.43 27.3,8.57 33.02,15.24 32.14,18.03 33.02,26.35 31.11,27.94 30.8,26.04 33.66,27.62 34.29,24.45 33.97,19.37 5.71,29.21 5.71,23.18 5.71,24.13 4.76,24.13 3.81,24.13 3.81,23.18 4.76,23.18 4.76,29.21 3.81,29.21 49.53,39.37 49.53,38.1 48.26,38.1 50.8,40.64 52.07,39.37 52.07,41.91 53.34,43.18 54.61,39.37 53.34,39.37 38.42,32.38 39.37,32.38 40.32,32.38 40.32,33.34 47.62,31.43 47.62,30.16 47.62,26.35 50.16,27.94 50.16,29.21 50.8,26.67 44.45,26.67 47.62,32.7 22.23,35.24 18.41,35.24 17.46,35.24 18.41,53.34 18.41,52.39 19.37,30.8 47.62,27.62 33.02,12.7 32.46,13.26 33.58,13.26 33.58,12.14 32.46,12.14 18.41,46.04 18.41,50.16 28.26,27.62 34.29,22.54 30.8,22.23 30.8,23.18 24.23,16.07 31.9,12.7 33.02,13.82 34.14,12.7 33.02,11.58 6.35,15.56 6.35,14.29 6.99,12.7 6.35,10.79 10.79,13.97 10.79,13.02 11.75,13.02 11.75,13.97 31.43,22.54 31.43,21.59 32.07,21.91 32.07,20.95 6.35,14.92 55.56,31.11 59.69,38.73 59.69,34.92 60.01,41.59 60.01,32.07 14.29,17.78 18.1,20.32 23.18,20.32 21.91,24.13 9.21,34.29 11.75,2.54 39.69,6.35 47.31,13.97 53.66,5.08 42.23,1.27 58.74,19.05 54.93,15.24 2.86,41.91 4.13,50.8 4.13,58.42 11.75,52.07 9.21,46.99 11.75,44.45 11.75,43.18 15.56,40.64 48.58,59.69 58.74,50.8 51.12,50.8 53.66,54.61 42.23,49.53 43.5,52.07 42.23,58.42 48.58,21.59 39.69,20.32 37.15,16.51 40.96,16.51 46.04,17.78 39.69,11.43 14.29,22.86 16.83,25.4 9.21,9.21 6.99,8.57 6.67,6.99 4.45,10.79 3.17,12.38 10.79,17.78 6.99,17.78 5.08,16.19 10.16,15.88
  pour Top (rank 3): 0,6.35 0,54.61 arc-90 6.35,60.96 54.61,60.96 arc-90 60.96,54.61 60.96,6.35 arc-90 54.61,0 6.35,0 arc-90
  pour Bottom (rank 3): 0,6.35 0,54.61 arc-90 6.35,60.96 54.61,60.96 arc-90 60.96,54.61 60.96,6.35 arc-90 54.61,0 6.35,0 arc-90
  pour Top (no thermals): 28.46,34.15 29.44,34.15 29.44,38.01 28.35,38.01 28.35,34.16 28.41,34.16
LA_1
  Top 0.254: R6.1 23.57,4.6 NOTIFY.2
LA_5
  Top 0.254: R1.1 39.28,58.42 5V.2
LA_CHG
  Top 0.254: R3.1 CHG.2
LA_USB
  Top 0.254: R5.1 USB.2
MISO  (via drill 0.25)
  Top 0.254: U3.20 29.82,13.36 v29.21,13.97
  Bottom 0.254: v29.21,13.97 26.35,13.97 J4.1
SYS_5V  (via drill 0.25)
  Top 0.254: U2_R1.1 v32.38,19.68 | U2_R9.1 27.53,9.39 R4.2 27.53,7.21 U2_R2.1 26.76,7.53 26.36,7.13 24.48,7.13 21.14,10.48 J4.2 | U3.9 34.74,11.66 U2_C2.2
  Top 0.381: R4.2 29.96,8.3 30.99,7.27 31.28,7.27 31.31,7.3 36.51,7.3 37.47,8.26 37.47,8.94 37.17,9.23 | 37.17,9.23 U2_C2.2 | v37.47,14.61 37.47,9.53 37.17,9.23
  Bottom 0.254: v32.38,19.68 32.38,19.19 32.77,18.8
  Bottom 0.762: J12.P1 19.37,32.21 32.77,18.8 34.95,16.62 35.45,16.62 v37.47,14.61
  pour Top: 27.94,56.52 18.73,56.52 18.73,59.37 19.68,60.33 34.61,60.33 35.56,59.37 35.56,57.78 29.21,57.78
U3_PA4
  Top 0.254: U3.1 27.28,12.04 U2_L2.2
U3_PA6
  Top 0.254: U2_L1.1 30.89,16.24 U3.16
U6_CBST
  Top 0.254: U6_CBST.1 30.33,58 U6.P$1
U6_FB
  Top 0.254: U6.P$3 30.86,56.9 30.87,56.88 U6_RFBT.2 | U6_RFBT.2 33.34,56.88 U6_CFF.1 | U6_RFBT.2 32.12,56.88 U6_RFBB.1
U6_SW
  Top 0.254: U6_CBST.2 29.53,59.21 29.53,57.15 U6.P$5 29.51,55.83 L2.1
U9_BGATE  (via drill 0.25, 0.38)
  Top 0.254: v37.78,43.5 Q1.P$4 | U9.10 31.81,32 31.83,32.02 32.65,32.02 v33.34,32.7
  Bottom 0.254: v33.34,32.7 37.78,37.15 v37.78,43.5
U9_BOOT  (via drill 0.25)
  Top 0.254: U9.19 27.23,33.09 v26.67,33.66 | U9_C5.1 v21.59,40.01
  Bottom 0.254: v21.59,40.01 21.59,38.73 v26.67,33.66
U9_CD  (via drill 0.25)
  Top 0.254: U9.24 27.23,27.86 27.27,27.83 27.27,27.66 v28.26,26.67
  Bottom 0.254: J14.1 44.9,23.18 43.69,21.96 33.1,21.96 28.38,26.67 v28.26,26.67
U9_DRV
  Top 0.254: J14.7 49.54,30.8 R3.2 51.13,27.94 | J11.1 C8.2 | 51.13,27.94 51.13,27.5 RHI.1 | J14.3 48.91,25.72 51.13,27.94
  Bottom 0.254: J11.1 41.46,25.72 42.67,24.5 43.69,24.5 44.9,25.72 J14.3
U9_DRV_0  (via drill 0.25)
  Top 0.254: J11.3 J11.2 | U9.6 30.46,27.64 v31.43,26.67
  Bottom 0.254: J11.2 33.4,23.18 31.47,25.12 31.47,26.64 v31.43,26.67
U9_IN
  pour Top (rank 2): 13.97,34.61 13.97,31.43 26.67,31.43 26.99,31.75 26.99,32.07 24.45,34.61
  pour Top (no thermals): 16.83,34.61 19.37,34.61 19.37,31.43 16.83,31.43 16.83,31.75
U9_INT  (via drill 0.25)
  Top 0.254: 30.19,10.57 U2_R9.2 | 30.19,10.57 U3.2 | v33.02,16.51 33.02,19.29 33.06,19.33 33.06,19.84 33.66,20.43 33.66,26.67 31.18,29.14 U9.7 | v29.84,11.11 29.84,10.91 30.19,10.57
  Bottom 0.254: v29.84,11.11 29.84,13.34 v33.02,16.51
U9_PMIDI
  Top 0.254: U9_C2.1 26.09,33.6 26.09,33.19 26.77,32.5 U9.20
U9_PMIDU
  Top 0.254: U9.23 27.15,30.92 26.69,30.92 26.53,30.75 26.53,28.26 U9_C6.1
U9_PSEL  (via drill 0.25)
  Top 0.254: U9.2 28.46,28.78 v28.26,28.57 | v40.32,26.99 43.81,26.99 44.45,27.62 v44.45,29.84
  Bottom 0.254: v28.26,28.57 38.73,28.57 v40.32,26.99 | v44.45,29.84 44.45,32.07 J14.9
U9_SCL
  Top 0.254: U2_L2.1 U2_R2.2 | U2_L2.1 26.26,11.66 26.18,11.74 26.18,11.97 28.96,14.75 U9.3 | J4.3 24.26,13.02 U2_L2.1
U9_SDA  (via drill 0.25)
  Top 0.254: U9.4 29.46,17.85 U2_L1.2 | U2_L1.2 30.07,17.37 U2_R1.2 | v29.84,15.88 29.86,17.08 U2_L1.2
  Bottom 0.254: v29.84,15.88 24.9,15.88 23.36,14.34 21.64,14.34 J4.4
U9_STAT
  Top 0.254: U9.8 31.67,31 31.83,30.85 33.86,30.85 34.66,31.65 42.31,31.65 42.67,32.02 55.84,32.02 CHG.1
U9_SW
  Top 0.254: 26.67,35.56 27.96,34.27 U9.18 27.55,33.73 27.3,33.97
  pour Top: 27.94,33.34 27.94,38.42 26.04,42.86 26.04,46.67 23.18,46.67 21.27,44.77 21.27,41.27 24.45,38.1 24.45,36.83
U9_SYS
  Top 0.254: 30.46,35.54 U9.13 | 30.46,35.54 30.48,35.56 | U9.14 29.96,35.04 30.46,35.54
  pour Top (rank 2): 29.84,33.34 31.43,33.34 43.28,39.42 43.26,45.2 41.78,46.67 29.84,46.67
U9_TS  (via drill 0.25)
  Top 0.254: RHI.2 55.32,24.56 R9.2 | RHI.2 RLO.1 | RHI.2 50.91,24.56 v50.16,25.4 | U9.9 32,31.5 v32.07,31.43
  Bottom 0.254: v32.07,31.43 40.64,31.43 42.6,29.48 43.69,29.48 44.4,28.76 44.4,27.67 45.17,26.9 45.22,26.94 48.63,26.94 v50.16,25.4
U9_USB
  Top 0.254: U9.22 26.03,31.5 C7.1 | J10.VBUS 6.68,16.84 3.81,13.97 3.81,12.5 6.85,9.46 7.99,9.46 R5.2
  Top 0.508: C7.1 11.51,16.98 8.21,16.98 J10.VBUS
  pour Top (no thermals): 25.25,30.35 25.63,30.35 26.67,31.39 27.13,31.39 27.13,31.6 25.35,31.6 25.25,31.5
VBAT  (via drill 0.25)
  Top 0.254: U9.12 31.73,33 31.75,33.02 | U9.11 32.31,32.5 32.46,32.65 32.65,32.65 32.38,33.02 | R2.2 30.57,7.03 30.8,6.8 36.67,6.8 44.48,14.61 v45.09,14.61
  Bottom 0.254: J14.12 43.18,35.06 41.96,33.84 41.96,32.83 42.67,32.12 43.93,32.12 44.5,32.69 44.5,33.84 45.22,34.56 46.86,34.56 51.7,29.71 51.7,24.21 51.44,23.94 51.44,20.95 v45.09,14.61
  pour Top (no thermals): 30.8,32.38 30.8,33.34 39.05,40.01 43.81,40.01 43.81,34.61 41.59,34.61 36.83,32.38
VBAT_CON
  Top 1.016: J14.11 45.77,35.83 J1.2
VCC  (via drill 0.25)
  Top 0.254: U6.P$2 31.11,57.4 v31.11,57.47 | U6.P$4 31.11,56.4 v31.11,56.2
  Top 0.762: U6_CIN.2 27.06,51.82 L2.2 30.48,50.8 v31.11,50.16 33.97,50.16 J16.2 J16.3
  Bottom 0.381: v31.11,50.16 v31.11,56.2 v31.11,57.47

### Text on the board
tPlace: S | S | G | G | D | D | BATT | GND | PSEL | DRV | GND | DRV | GND | CD | ENABLE